# Altium schematic sheet 6-Connectors.SchDoc: Thermocouple Temperature Logger
size A4; Date: 14.03.2026; Author: MG & JK; Revision: 1-0; SheetNumber: 6; SheetTotal: 7; Model: Rev 1.0; PageSetup: Record=PageOptions|CenterHorizontal=True|CenterVertical=True|PrintScale=0.52|XCorrection=1.00|YCorrection=1.00|PrintKind=1|BorderSize=5000000|LeftOffset=0|BottomOffset=0|Orientation=2|PaperLength=4200|PaperWidth=2970|Scale=100|PaperSource=7|PrintQuality=600|MediaType=1|DitherType=10|PaperKind=A3|PrintScaleMode=1
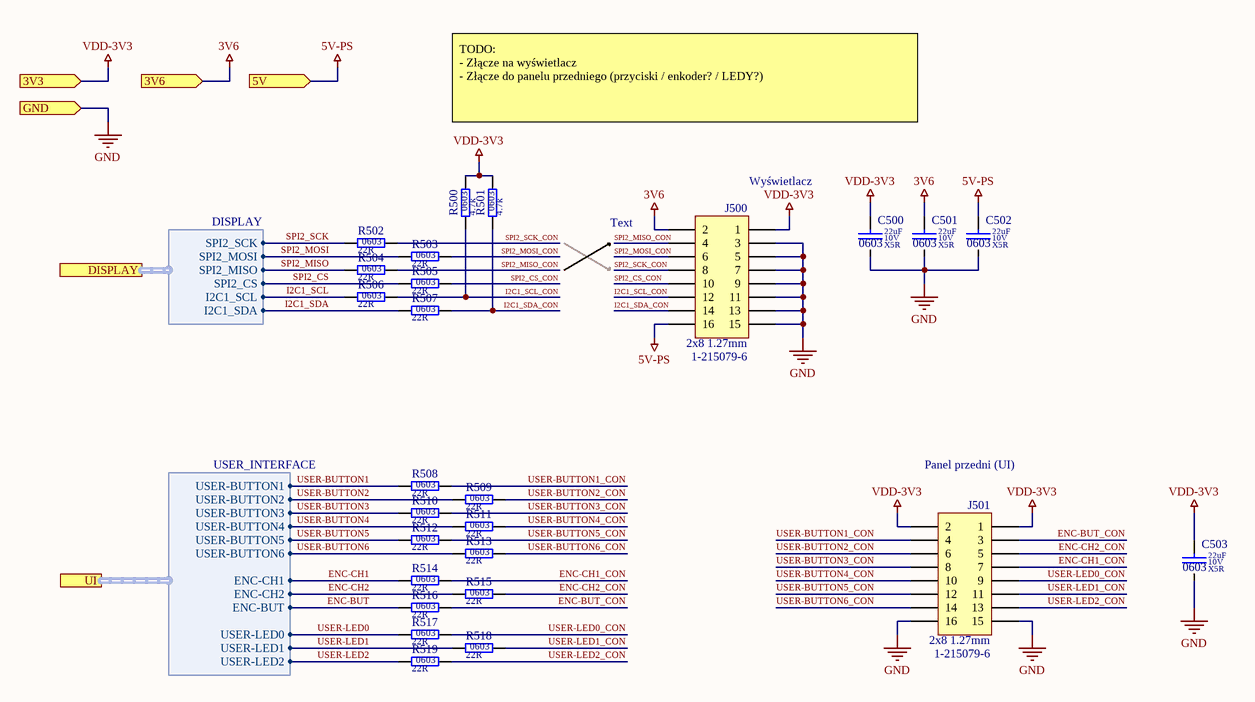
[diagram p0: 6-Connectors.SchDoc]

## Parts
C500  value 22uF  Dielectric: X5R  Voltage: 10V  SCH_Footprint: 0603  [C_0603_1608]  (hidden comment: Ceramic X5R)
C501  value 22uF  Dielectric: X5R  Voltage: 10V  SCH_Footprint: 0603  [C_0603_1608]  (hidden comment: Ceramic X5R)
C502  value 22uF  Dielectric: X5R  Voltage: 10V  SCH_Footprint: 0603  [C_0603_1608]  (hidden comment: Ceramic X5R)
C503  value 22uF  Dielectric: X5R  Voltage: 10V  SCH_Footprint: 0603  [C_0603_1608]  (hidden comment: Ceramic X5R)
J500  value 1-215079-6  SCH_Footprint: 2x8 1.27mm  [J_Micro-Match_2x8_THT]  (hidden comment: Micro-Match 16-pin)
J501  value 1-215079-6  SCH_Footprint: 2x8 1.27mm  [J_Micro-Match_2x8_THT]  (hidden comment: Micro-Match 16-pin)
R500  value 4.7k  SCH_Footprint: 0603  [R_0603_1608]  (hidden comment: Resistor)
R501  value 4.7k  SCH_Footprint: 0603  [R_0603_1608]  (hidden comment: Resistor)
R502  value 22R  SCH_Footprint: 0603  [R_0603_1608]  (hidden comment: Resistor)
R503  value 22R  SCH_Footprint: 0603  [R_0603_1608]  (hidden comment: Resistor)
R504  value 22R  SCH_Footprint: 0603  [R_0603_1608]  (hidden comment: Resistor)
R505  value 22R  SCH_Footprint: 0603  [R_0603_1608]  (hidden comment: Resistor)
R506  value 22R  SCH_Footprint: 0603  [R_0603_1608]  (hidden comment: Resistor)
R507  value 22R  SCH_Footprint: 0603  [R_0603_1608]  (hidden comment: Resistor)
R508  value 22R  SCH_Footprint: 0603  [R_0603_1608]  (hidden comment: Resistor)
R509  value 22R  SCH_Footprint: 0603  [R_0603_1608]  (hidden comment: Resistor)
R510  value 22R  SCH_Footprint: 0603  [R_0603_1608]  (hidden comment: Resistor)
R511  value 22R  SCH_Footprint: 0603  [R_0603_1608]  (hidden comment: Resistor)
R512  value 22R  SCH_Footprint: 0603  [R_0603_1608]  (hidden comment: Resistor)
R513  value 22R  SCH_Footprint: 0603  [R_0603_1608]  (hidden comment: Resistor)
R514  value 22R  SCH_Footprint: 0603  [R_0603_1608]  (hidden comment: Resistor)
R515  value 22R  SCH_Footprint: 0603  [R_0603_1608]  (hidden comment: Resistor)
R516  value 22R  SCH_Footprint: 0603  [R_0603_1608]  (hidden comment: Resistor)
R517  value 22R  SCH_Footprint: 0603  [R_0603_1608]  (hidden comment: Resistor)
R518  value 22R  SCH_Footprint: 0603  [R_0603_1608]  (hidden comment: Resistor)
R519  value 22R  SCH_Footprint: 0603  [R_0603_1608]  (hidden comment: Resistor)

## Ports
3V3 (in, see 1-Block-diagram[4C], 2-STM32H563[2A], 3-Power-Supply[2D], 4-Ethernet[1A], 5-SD-Card[1A]), 3V6 (in, see 1-Block-diagram[4C], 3-Power-Supply[3B], 7-LTC2983[1A]), 5V (in, see 1-Block-diagram[4C], 3-Power-Supply[3A]), DISPLAY (harness DISPLAY, see 1-Block-diagram[4D], 2-STM32H563[1B]), GND (in, see 1-Block-diagram[4C], 2-STM32H563[2A], 3-Power-Supply[3A], 4-Ethernet[1A], 5-SD-Card[1A], 7-LTC2983[1A]), UI (harness USER_INTERFACE, see 1-Block-diagram[4D], 2-STM32H563[1B])

## Harnesses
DISPLAY: SPI2_SCK, SPI2_MOSI, SPI2_MISO, SPI2_CS, I2C1_SCL, I2C1_SDA
USER_INTERFACE: ENC-CH2, ENC-BUT, USER-BUTTON1, USER-BUTTON2, USER-BUTTON3, USER-BUTTON4, USER-BUTTON5, USER-BUTTON6, ENC-CH1, USER-LED2, USER-LED1, USER-LED0

## Nets
3V6: C501.1 J500.2 ; port 3V6
5V-PS: C502.1 J500.16 ; port 5V
GND: C500.2 C501.2 C502.2 C503.2 J500.3 J500.5 J500.7 J500.9 J500.11 J500.13 J500.15 J501.15 J501.16 ; port GND
VDD-3V3: C500.1 C503.1 J500.1 J501.1 J501.2 R500.2 R501.2 ; port 3V3
ENC-BUT: R516.1 ; port UI.ENC-BUT
ENC-BUT_CON: J501.3 R516.2
ENC-CH1: R514.1 ; port UI.ENC-CH1
ENC-CH1_CON: J501.7 R514.2
ENC-CH2: R515.1 ; port UI.ENC-CH2
ENC-CH2_CON: J501.5 R515.2
I2C1_SCL: R506.1 ; port DISPLAY.I2C1_SCL
I2C1_SCL_CON: J500.12 R500.1 R506.2
I2C1_SDA: R507.1 ; port DISPLAY.I2C1_SDA
I2C1_SDA_CON: J500.14 R501.1 R507.2
SPI2_CS: R505.1 ; port DISPLAY.SPI2_CS
SPI2_CS_CON: J500.10 R505.2
SPI2_MISO: R504.1 ; port DISPLAY.SPI2_MISO
SPI2_MISO_CON: J500.4 R504.2
SPI2_MOSI: R503.1 ; port DISPLAY.SPI2_MOSI
SPI2_MOSI_CON: J500.6 R503.2
SPI2_SCK: R502.1 ; port DISPLAY.SPI2_SCK
SPI2_SCK_CON: J500.8 R502.2
USER-BUTTON1: R508.1 ; port UI.USER-BUTTON1
USER-BUTTON1_CON: J501.4 R508.2
USER-BUTTON2: R509.1 ; port UI.USER-BUTTON2
USER-BUTTON2_CON: J501.6 R509.2
USER-BUTTON3: R510.1 ; port UI.USER-BUTTON3
USER-BUTTON3_CON: J501.8 R510.2
USER-BUTTON4: R511.1 ; port UI.USER-BUTTON4
USER-BUTTON4_CON: J501.10 R511.2
USER-BUTTON5: R512.1 ; port UI.USER-BUTTON5
USER-BUTTON5_CON: J501.12 R512.2
USER-BUTTON6: R513.1 ; port UI.USER-BUTTON6
USER-BUTTON6_CON: J501.14 R513.2
USER-LED0: R517.1 ; port UI.USER-LED0
USER-LED0_CON: J501.9 R517.2
USER-LED1: R518.1 ; port UI.USER-LED1
USER-LED1_CON: J501.11 R518.2
USER-LED2: R519.1 ; port UI.USER-LED2
USER-LED2_CON: J501.13 R519.2

## Notes on the sheet
- TODO:
  - Złącze na wyświetlacz
  - Złącze do panelu przedniego (przyciski / enkoder? / LEDY?)
- Text
- (near J500) Wyświetlacz
- Panel przedni (UI)
- Title:
- Sheet:
- of
- Author:
- Model:
- Document Number:
- Checked by:
- Iss-Rev:
- Approved by:
- Date:
- File name:

## Library data of the parts
C500-C503 = C_22uF_10V_X5R_0603_20: Capacitor; Manufacturer: Murata; Manufacturer Part Number: GRM188R61A226ME15D; Tolerance (%): 20; Part Number: C_22uF_10V_X5R_0603_20; HelpURL: https://www.mouser.pl/datasheet/2/281/1/GRM188R61A226ME15_02A-1985787.pdf; Supplier 1: TME; Supplier Part Number 1: GRM188R61A226ME15D; Supplier 2: RS Components; Supplier 3: Farnell; Supplier Part Number 3: 2426957; Supplier 4: Mouser; Supplier Part Number 4: 81-GRM188R61A226ME5D; Supplier 5: Digi-Key; Supplier Part Number 5: 490-10476-1-ND; Supplier 6: LCSC
J500 J501 = J_Micro-Match_2x8_THT: Pin Header; Manufacturer: TE Connectivity; Part Number: J_Micro-Match_2x8_THT; HelpURL: https://datasheet.octopart.com/1-215079-6-TE-Connectivity-datasheet-11077960.pdf; Manufacturer Part Number: 1-215079-6; Supplier 1: TME; Supplier Part Number 1: AMP-8-215079-6; Supplier 2: RS Components; Supplier Part Number 2: 6804980; Supplier 3: Farnell; Supplier Part Number 3: 1772986; Supplier 4: Mouser; Supplier Part Number 4: 571-1-215079-6; Supplier 5: Digi-Key; Supplier Part Number 5: A110872CT-ND; Supplier 6: LCSC
R500 R501 = R_4.7k_0603_1: Manufacturer: Yageo; Manufacturer Part Number: RC0603FR-074K7L; Voltage: 75V; Power: 100mW; Tolerance: 1%; Part Number: R_4.7k_0603_1; HelpURL: http://www.farnell.com/datasheets/2167052.pdf?_ga=2.156163131.1690599162.1548417389-1379097396.1542296996&_gac=1.18389067.1547230258.Cj0KCQiAmuHhBRD0ARIsAFWyPwhX8HcvXnM3tA0ZBodZLzDIjH2ZxLpjT5LWo9bad_HPRbU8LfPq44UaAhEwEALw_wcB; Supplier 1: TME; Supplier Part Number 1: RC0603FR-074K7; Supplier 2: RS Components; Supplier 3: Farnell; Supplier Part Number 3: 9238565; Supplier 4: Mouser; Supplier Part Number 4: 603-RC0603FR-074K7L; Supplier 5: Digi-Key; Supplier Part Number 5: 311-4.70KHRCT-ND; Supplier 6: LCSC
R502-R519 = R_22R_0603_5: Manufacturer: Walsin; Manufacturer Part Number: WF06P220JTL; Voltage: 50V; Power: 125mW; Tolerance: 5%; Part Number: R_22R_0603_5; HelpURL: http://www.tme.eu/pl/Document/b315665a56acbc42df513c99b390ad98/ROYALOHM-THICKFILM.pdf; Supplier 1: TME; Supplier Part Number 1: WF06P-22R-5%; Supplier 2: RS Components; Supplier 3: Farnell; Supplier 4: Mouser; Supplier 5: Digi-Key; Supplier 6: LCSC